# Altium schematic sheet GSM.SchDoc
size A
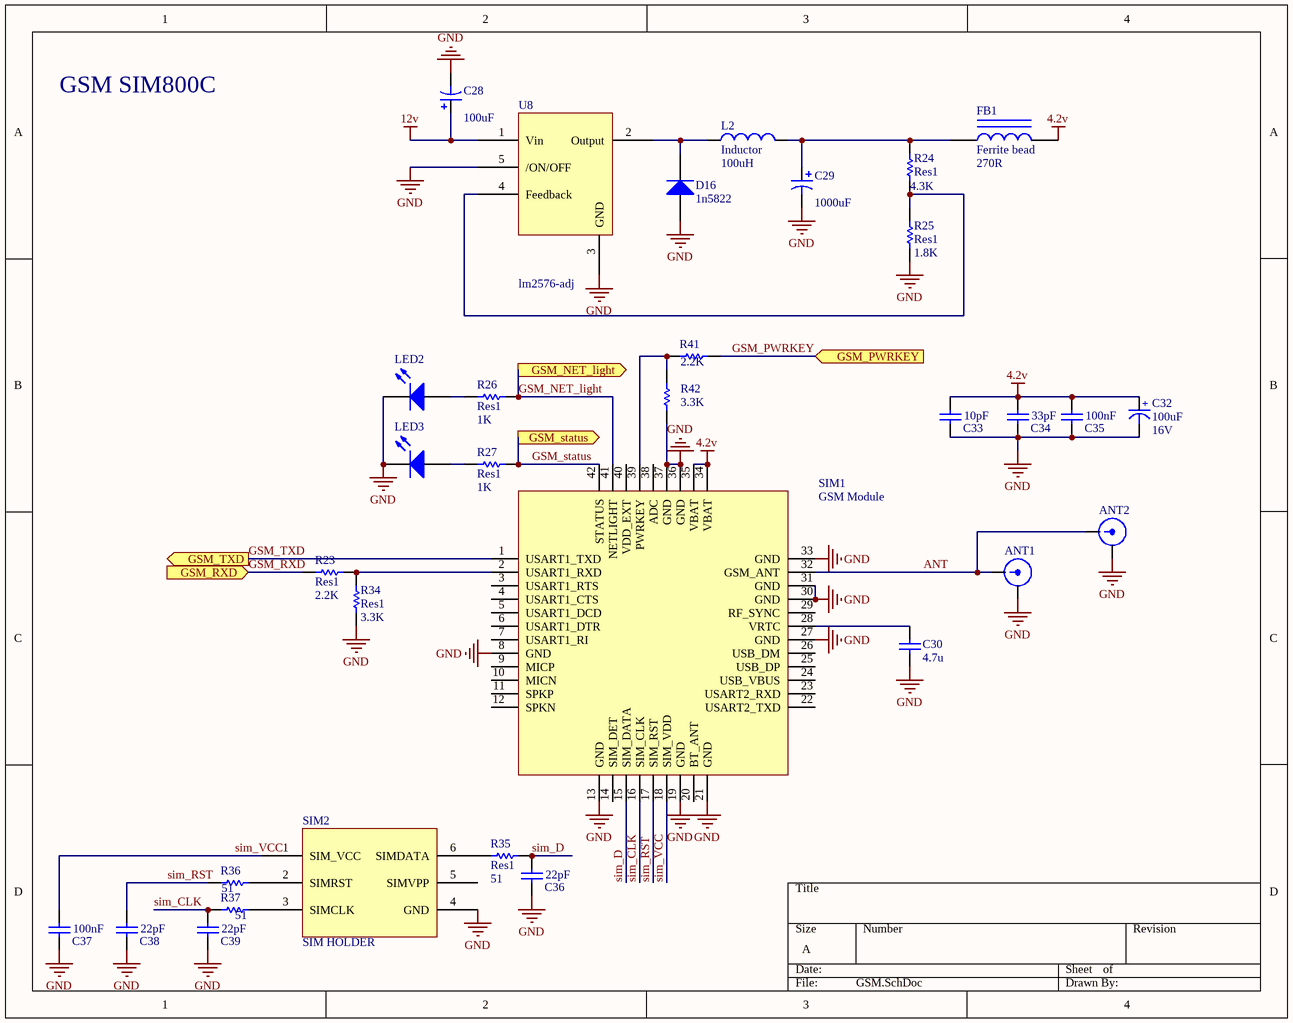
[diagram p0: GSM.SchDoc]

## Parts
ANT1  Antenna  [SMA]  (value not drawn)
ANT2  Antenna  [UFL ant]  (value not drawn)
C28  value 100uF  [Cap SMD 100UF 35~50v]
C29  value 1000uF  [CAP SMD 1000UF 16V]
C30  value 4.7u  [CAP 1206 (3216X15L)]  (hidden comment: Cap)
C32  Voltage: 16V  [cap 01]  (hidden comment: 100uF)
C33  value 10pF  [CAP 1206 (3216X15L)]  (hidden comment: Cap)
C34  value 33pF  [CAP 1206 (3216X15L)]  (hidden comment: Cap)
C35  value 100nF  [CAP 1206 (3216X15L)]  (hidden comment: Cap)
C36  value 22pF  [CAP 1206 (3216X15L)]  (hidden comment: Cap)
C37  value 100nF  [CAP 1206 (3216X15L)]  (hidden comment: Cap)
C38  value 22pF  [CAP 1206 (3216X15L)]  (hidden comment: Cap)
C39  value 22pF  [CAP 1206 (3216X15L)]  (hidden comment: Cap)
D16  1n5822  [SMA DIODE 2]
FB1  Ferrite bead  value 270R  [FB1206]
L2  Inductor  value 100uH  [inductor]
LED2  LED  [LED 1206]  (value not drawn)
LED3  LED  [LED 1206]  (value not drawn)
R23  Res1  value 2.2K  [RES 1206 (3216X08L)]
R24  Res1  value 4.3K  [RES 1206 (3216X08L)]
R25  Res1  value 1.8K  [RES 1206 (3216X08L)]
R26  Res1  value 1K  [RES 1206 (3216X08L)]
R27  Res1  value 1K  [RES 1206 (3216X08L)]
R34  Res1  value 3.3K  [RES 1206 (3216X08L)]
R35  Res1  value 51  [RES 1206 (3216X08L)]
R36  value 51  [RES 1206 (3216X08L)]  (hidden comment: Res1)
R37  value 51  [RES 1206 (3216X08L)]  (hidden comment: Res1)
R41  value 2.2K  [RES 1206 (3216X08L)]  (hidden comment: Res1)
R42  value 3.3K  [RES 1206 (3216X08L)]  (hidden comment: Res1)
SIM1  GSM Module  [SIM800C]
SIM2  SIM HOLDER  [simcard_holder]
U8  lm2576-adj  [2596]

## Ports
GSM_NET_light (out), GSM_PWRKEY (in), GSM_RXD (in), GSM_status (out), GSM_TXD (out)

## Nets
4.2v: C32.1(+) C33.2 C34.2 C35.2 FB1.2 SIM1.34(VBAT) SIM1.35(VBAT)
12v: C28.1 U8.1(Vin)
GND: ANT1.2 ANT2.2 C28.2 C29.2 C30.1 C32.2(-) C33.1 C34.1 C35.1 C36.1 C37.1 C38.1 C39.1 D16.1(A) LED2.K LED3.K R25.1 R34.2 R42.1 SIM1.8(GND) SIM1.13(GND) SIM1.19(GND) SIM1.21(GND) SIM1.27(GND) SIM1.30(GND) SIM1.31(GND) SIM1.33(GND) SIM1.36(GND) SIM1.37(GND) SIM2.4(GND) U8.3(GND) U8.5(/ON/OFF)
ANT: ANT1.1 ANT2.1 SIM1.32(GSM_ANT)
GSM_NET_light: R26.1 SIM1.41(NETLIGHT) ; port GSM_NET_light
GSM_PWRKEY: R41.1 ; port GSM_PWRKEY
GSM_RXD: R23.2 ; port GSM_RXD
GSM_status: R27.1 SIM1.42(STATUS) ; port GSM_status
GSM_TXD: SIM1.1(USART1_TXD) ; port GSM_TXD
sim_CLK: C39.2 R37.1 SIM1.16(SIM_CLK)
sim_D: C36.2 R35.2 SIM1.15(SIM_DATA)
sim_RST: C38.2 R36.1 SIM1.17(SIM_RST)
sim_VCC: C37.2 SIM1.18(SIM_VDD) SIM2.1(SIM_VCC)
NetC29_1: C29.1 FB1.1 L2.2 R24.2
NetC30_2: C30.2 SIM1.28(VRTC)
NetD16_2: D16.2(K) L2.1 U8.2(Output)
NetLED2_A: LED2.A R26.2
NetLED3_A: LED3.A R27.2
NetR23_1: R23.1 R34.1 SIM1.2(USART1_RXD)
NetR24_1: R24.1 R25.2 U8.4(Feedback)
NetR35_1: R35.1 SIM2.6(SIMDATA)
NetR36_2: R36.2 SIM2.2(SIMRST)
NetR37_2: R37.2 SIM2.3(SIMCLK)
NetR41_2: R41.2 R42.2 SIM1.39(PWRKEY)

Not connected (* = marked no-connect by the designer): SIM1 3(USART1_RTS) 4(USART1_CTS) 5(USART1_DCD) 6(USART1_DTR) 7(USART1_RI) 9(MICP) 10(MICN) 11(SPKP) 12(SPKN) 14(SIM_DET) 20(BT_ANT) 22(USART2_TXD) 23(USART2_RXD) 24(USB_VBUS) 25(USB_DP) 26(USB_DM) 29(RF_SYNC) 38(ADC) 40(VDD_EXT); SIM2 5(SIMVPP)

## Notes on the sheet
- GSM SIM800C

## Library data of the parts
ANT1 = ANT SMA: Designer: Ali Hafizi
ANT2 = ANT SMA: pin to pad: 1>S 2>G; Designer: Ali Hafizi
C28 C29 = Cap Pol1: Polarized Capacitor (Radial); Published: 8-Jun-2000; LatestRevisionDate: 17-Jul-2002; LatestRevisionNote: Re-released for DXP Platform.; PackageReference: RB7.6-15; Publisher: Altium Limited; PackageDescription: Polarized Capacitor (Radial); 2 Leads
C30 C33-C39 = Cap ceramic: CAP-100Nf
C32 = Cap-Polar: Polar Capacitor; Designer: Saeid Jorablo; Organazation: ControTec; Adding Date: 1387/12/20; Value: 100uF
D16 = Diode 1N4007: 1 Amp General Purpose Rectifier; Published: 8-Jun-2000; LatestRevisionDate: 17-Jul-2002; LatestRevisionNote: Re-released for DXP Platform.; DatasheetVersion: 1998; PackageVersion: Aug-1999; PackageReference: DO-41; Publisher: Altium Limited; PackageDescription: Diode, Axial; Body 5.2 x 2.7 mm (LxDia. max), Lead Dia. 0.86 mm (max); Code_JEDEC: DO-204-AL; ComponentLink1Description: Manufacturer Link; ComponentLink1URL: http://www.fairchildsemi.com/; ComponentLink2Description: Datasheet; ComponentLink2URL: http://www.fairchildsemi.com/ds/1N%2F1N4001.pdf
FB1 = Inductor Iron: Magnetic-Core Inductor; Published: 24-Mar-1999; LatestRevisionDate: 17-Jul-2002; LatestRevisionNote: Re-released for DXP Platform.; PackageReference: AXIAL-0.9; Publisher: Altium Limited; PackageDescription: Axial Device, Thru-Hole; 2 Leads; 0.9 in Pin Spacing
L2 = Inductor: Code_IEC: 1005; Published: 8-Jun-2000; LatestRevisionDate: 29-May-2009; LatestRevisionNote: IPC-7351 Footprint Added.; PackageReference: 0402-A; Publisher: Altium Limited; PackageDescription: Chip Inductor; Code_JEITA: 0402
LED2 LED3 = LED: Typical INFRARED GaAs LED; pin to pad: A>1 K>2; Published: 8-Jun-2000; LatestRevisionDate: 08-Jul-2005; LatestRevisionNote: Mech Layer 1 removed.; Publisher: Altium Limited
R23-R27 R34-R37 R41 R42 = Res1: Resistor; Published: 8-Jun-2000; LatestRevisionDate: 17-Jul-2002; LatestRevisionNote: Re-released for DXP Platform.; PackageReference: AXIAL-0.3; Publisher: Altium Limited; PackageDescription: Axial Device, Thru-Hole; 2 Leads; 0.3 in Pin Spacing
SIM1 = SIM800C: Designer: Ali Hafizi
SIM2 = SIM HOLDER: Deigner: Ali Hafizi
U8 = lm2596